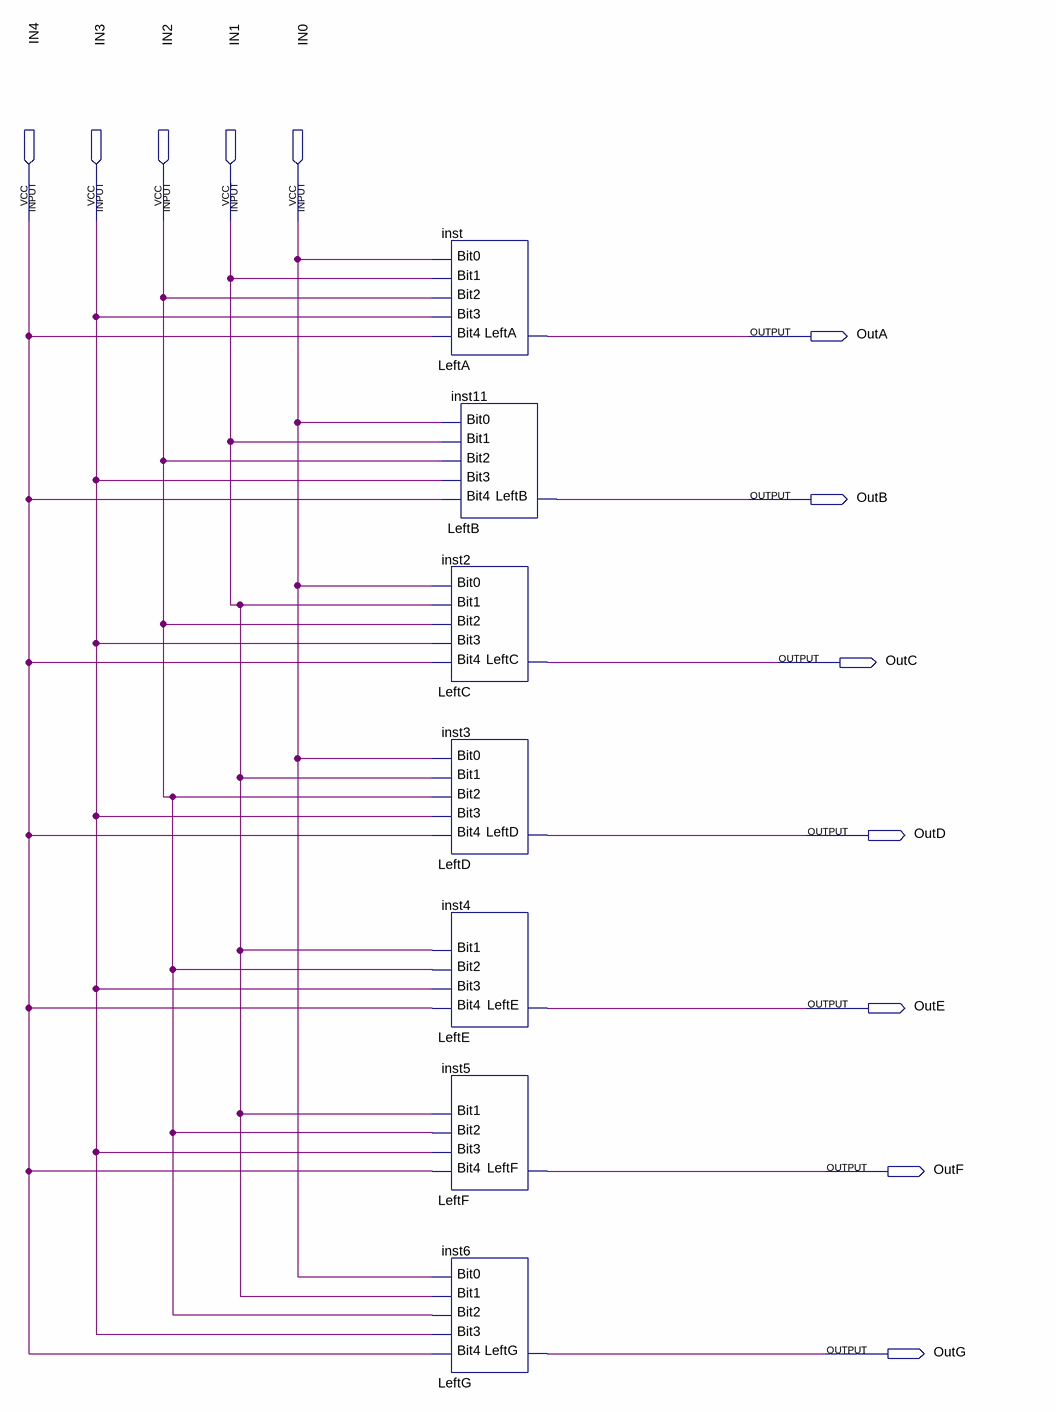
[diagram p0: schematic sheet]
// Quartus schematic L-DECOD.bdf as structural Verilog: 7 symbols, 12 pins
module \L-DECOD  (
  input  IN4,
  input  IN3,
  input  IN2,
  input  IN1,
  input  IN0,
  output OutA,
  output OutB,
  output OutC,
  output OutD,
  output OutE,
  output OutF,
  output OutG
);

  LeftA inst (.Bit4(IN4), .Bit3(IN3), .Bit2(IN2), .Bit1(IN1), .Bit0(IN0), .LeftA(OutA));
  LeftB inst11 (.Bit4(IN4), .Bit3(IN3), .Bit2(IN2), .Bit1(IN1), .Bit0(IN0), .LeftB(OutB));
  LeftC inst2 (.Bit4(IN4), .Bit3(IN3), .Bit2(IN2), .Bit1(IN1), .Bit0(IN0), .LeftC(OutC));
  LeftD inst3 (.Bit4(IN4), .Bit3(IN3), .Bit2(IN2), .Bit1(IN1), .Bit0(IN0), .LeftD(OutD));
  LeftE inst4 (.Bit4(IN4), .Bit3(IN3), .Bit2(IN2), .Bit1(IN1), .LeftE(OutE));
  LeftF inst5 (.Bit4(IN4), .Bit3(IN3), .Bit2(IN2), .Bit1(IN1), .LeftF(OutF));
  LeftG inst6 (.Bit4(IN4), .Bit3(IN3), .Bit2(IN2), .Bit1(IN1), .Bit0(IN0), .LeftG(OutG));
endmodule
